# EAGLE schematic controller (EAGLE 7.2.0)
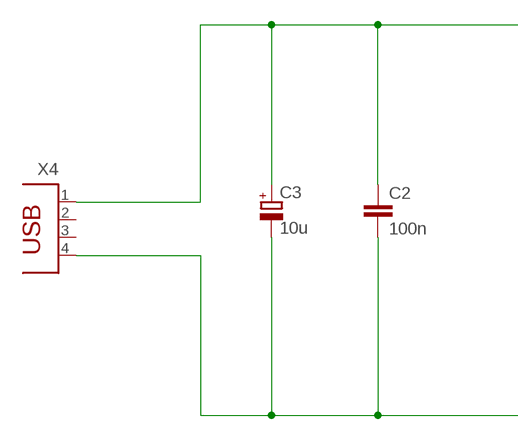
[diagram p0: schematic, sheet 1, part 1 of 2]
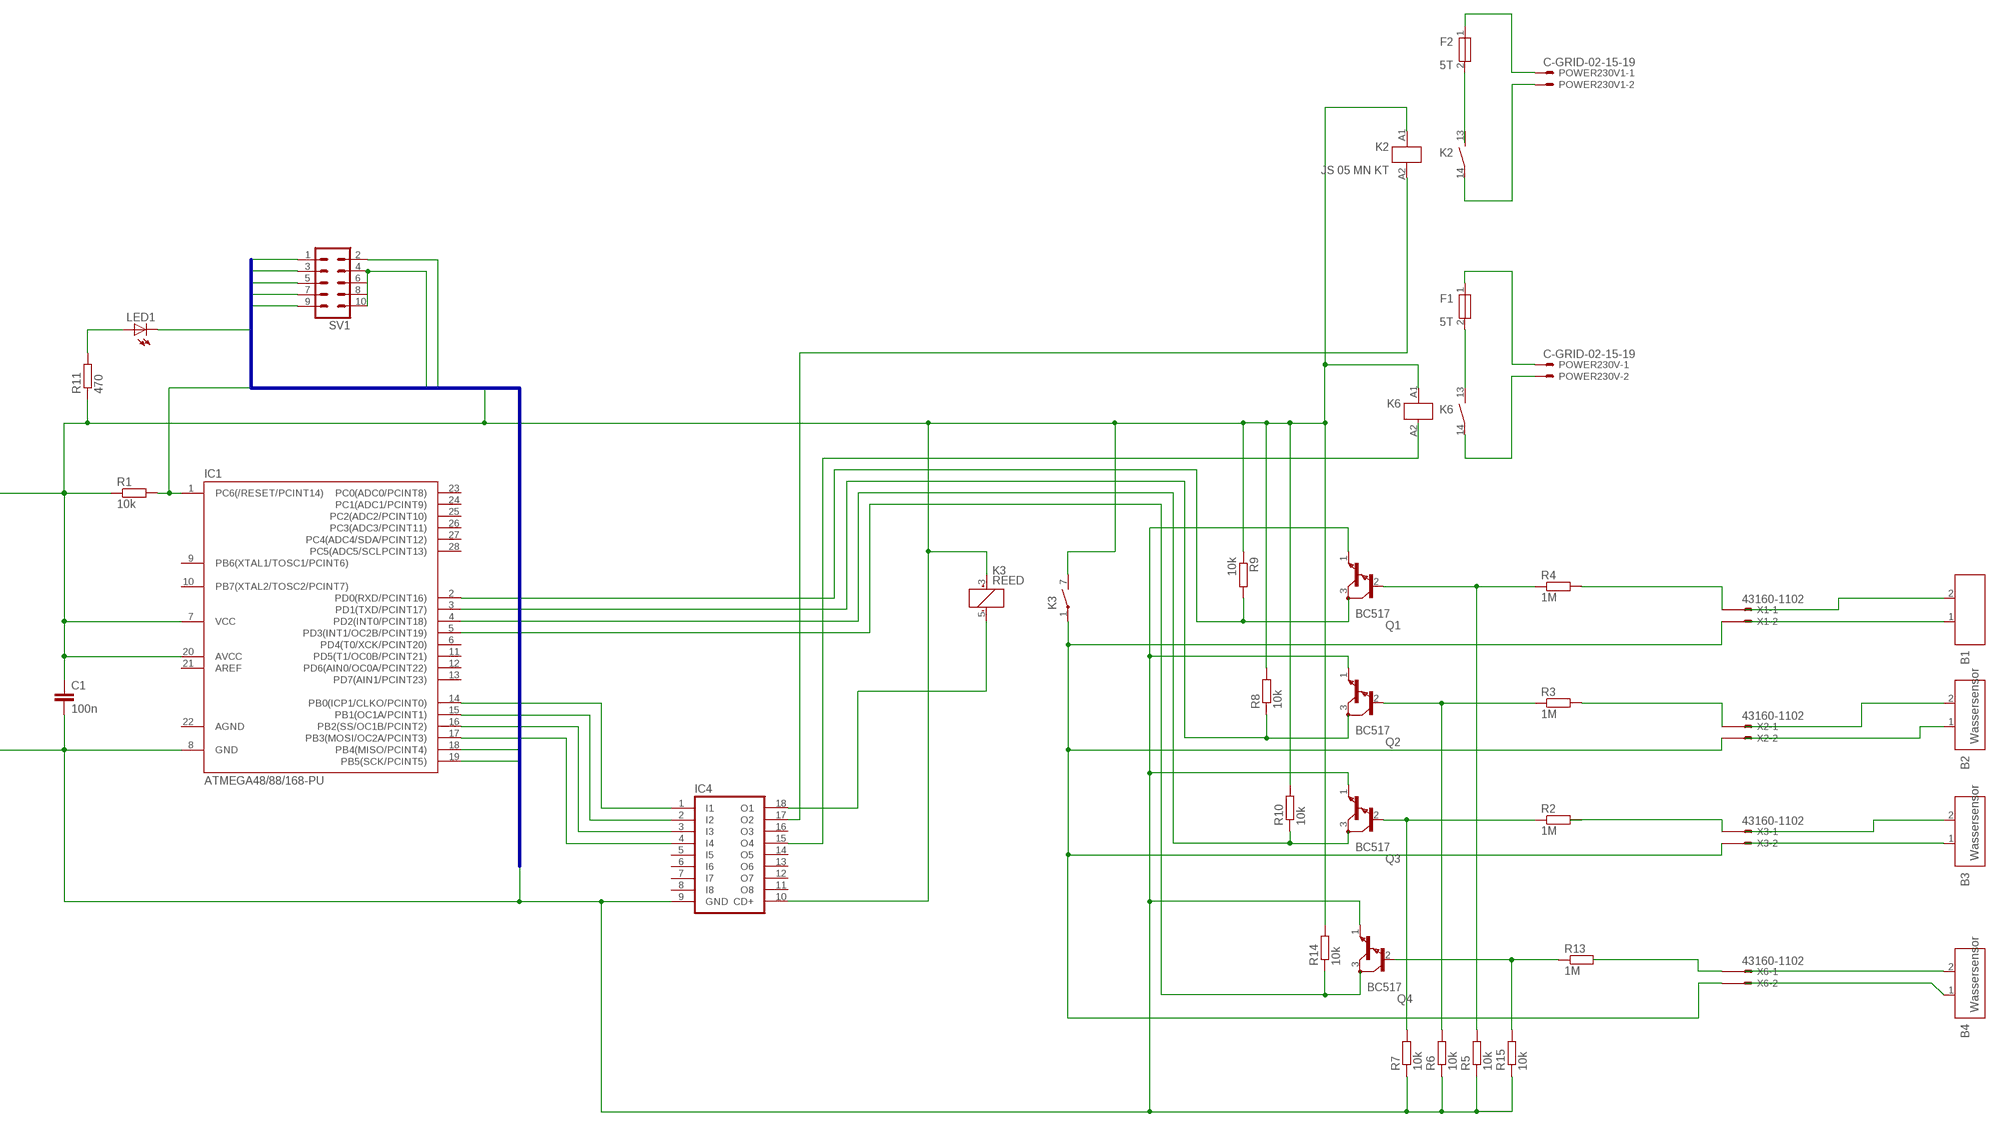
[diagram p1: schematic, sheet 1, part 2 of 2]

## Parts
B1  MESSFUEHLER_2  [MESSFUEHLER_2]
B2  MESSFUEHLER_2  [MESSFUEHLER_2]
B3  MESSFUEHLER_2  [MESSFUEHLER_2]
B4  MESSFUEHLER_2  [MESSFUEHLER_2]
C1  100n  C-EU025-025X050  [C025-025X050]
C2  100n  C-EU025-030X050  [C025-030X050]
C3  10u  CPOL-EUE2.5-7  [E2,5-7]
F1  SICHERUNG_1-POL  [SICHERUNG_1-POL]
F2  SICHERUNG_1-POL  [SICHERUNG_1-POL]
IC1  ATMEGA48/88/168-PU  [DIL28-3]
IC4  ULN2803A  [DIL18]
K2  HILFSSCHUETZ_13-14  [HILFSSCHUETZ_13-14]
K3  REED  [REED]
K6  HILFSSCHUETZ_13-14  [HILFSSCHUETZ_13-14]
LED1  LED5MM  [LED5MM]
POWER230V  C-GRID-02-15-19  [15-91-02]
POWER230V1  C-GRID-02-15-19  [15-91-02]
Q1  BC517  [TO92]
Q2  BC517  [TO92]
Q3  BC517  [TO92]
Q4  BC517  [TO92]
R1  10k  R-EU_0204/7  [0204/7]
R2  1M  R-EU_0204/7  [0204/7]
R3  1M  R-EU_0204/7  [0204/7]
R4  1M  R-EU_0204/7  [0204/7]
R5  10k  R-EU_0204/7  [0204/7]
R6  10k  R-EU_0204/7  [0204/7]
R7  10k  R-EU_0204/7  [0204/7]
R8  10k  R-EU_0204/7  [0204/7]
R9  10k  R-EU_0204/7  [0204/7]
R10  10k  R-EU_0204/7  [0204/7]
R11  470  R-EU_0204/7  [0204/7]
R13  1M  R-EU_0204/7  [0204/7]
R14  10k  R-EU_0204/7  [0204/7]
R15  10k  R-EU_0204/7  [0204/7]
SV1  MA05-2  [MA05-2]
X1  43160-1102  [43160-XX02]
X2  43160-1102  [43160-XX02]
X3  43160-1102  [43160-XX02]
X4  PN87520  [PN87520]
X6  43160-1102  [43160-XX02]

## Nets
GND: C1.2 C2.2 C3.- IC1.8(GND) IC4.9(GND) Q1.1(E) Q2.1(E) Q3.1(E) Q4.1(E) R5.1 R6.1 R7.1 R15.1 SV1.2 SV1.4 SV1.10 X4.4
LED: LED1.K(C) SV1.3
MISO: IC1.18(PB4(MISO/PCINT4)) SV1.9
MOSI: IC1.17(PB3(MOSI/OC2A/PCINT3)) IC4.4(I4) SV1.1
N$1: IC4.15(O4)
N$2: LED1.A R11.2
N$3: IC4.18(O1) K3.5(1:-)
N$4: B4.2
N$5: B4.1
N$6: IC1.14(PB0(ICP1/CLKO/PCINT0)) IC4.1(I1)
N$7: IC1.15(PB1(OC1A/PCINT1)) IC4.2(I2)
N$8: IC1.16(PB2(SS/OC1B/PCINT2)) IC4.3(I3)
N$9: K3.1(2:P) X1.2@1(-2:S) X2.2@1(-2:S) X3.2@1(-2:S) X6.2@1(-2:S)
N$10: X6.1@1(-1:S)
N$11: Q4.2(B) R13.1 R15.2
N$12: Q3.2(B) R2.1 R7.2
N$13: Q2.2(B) R3.1 R6.2
N$14: Q1.2(B) R4.1 R5.2
N$15: R4.2 X1.1@1(-1:S)
N$16: R3.2 X2.1@1(-1:S)
N$17: R2.2 X3.1@1(-1:S)
N$18: IC1.5(PD3(INT1/OC2B/PCINT19)) Q4.3(C) R14.1
N$19: IC1.2(PD0(RXD/PCINT16)) Q1.3(C) R9.2
N$20: B1.2
N$21: B1.1
N$22: IC1.3(PD1(TXD/PCINT17)) Q2.3(C) R8.1
N$23: IC1.4(PD2(INT0/PCINT18)) Q3.3(C) R10.1
N$24: B2.2
N$25: B2.1
N$26: B3.2
N$27: B3.1
N$28: F1.2 K6.13
N$30: K6.14 POWER230V.2
N$31: IC4.17(O2) K2.A2
N$32: F1.1 POWER230V.1
N$33: F2.2
N$34: F2.1 POWER230V1.1
N$35: K2.14 POWER230V1.2
RESET: IC1.1(PC6(/RESET/PCINT14)) R1.2 SV1.5
SCK: IC1.19(PB5(SCK/PCINT5)) SV1.7
VCC: C1.1 C2.1 C3.+ IC1.7(VCC) IC1.20(AVCC) IC4.10(CD+) K2.A1 K3.3(1:+) K3.7(2:S) K6.A1 R1.1 R8.2 R9.1 R10.2 R11.1 R14.2 X4.1
Unconnected: IC1.6(PD4(T0/XCK/PCINT20)) IC1.9(PB6(XTAL1/TOSC1/PCINT6)) IC1.10(PB7(XTAL2/TOSC2/PCINT7)) IC1.11(PD5(T1/OC0B/PCINT21)) IC1.12(PD6(AIN0/OC0A/PCINT22)) IC1.13(PD7(AIN1/PCINT23)) IC1.21(AREF) IC1.23(PC0(ADC0/PCINT8)) IC1.24(PC1(ADC1/PCINT9)) IC1.25(PC2(ADC2/PCINT10)) IC1.26(PC3(ADC3/PCINT11)) IC1.27(PC4(ADC4/SDA/PCINT12)) IC1.28(PC5(ADC5/SCLPCINT13)) IC4.5(I5) IC4.6(I6) IC4.7(I7) IC4.8(I8) IC4.11(O8) IC4.12(O7) IC4.13(O6) IC4.14(O5) IC4.16(O3) K2.13 K6.A2 R13.2 SV1.6 SV1.8 X1.1@2(-1:S) X1.2@2(-2:S) X2.1@2(-1:S) X2.2@2(-2:S) X3.1@2(-1:S) X3.2@2(-2:S) X4.2 X4.3 X6.1@2(-1:S) X6.2@2(-2:S)

## Buses
MOSI,LED,RESET,SCK,MISO,VCC,GND

## Power pins joined to a net without a drawn wire
AGND: IC1.22(AGND)

## Library data of the parts
B1-B4 = e-messfuehler:MESSFUEHLER_2: Messfühler mit zwei Anschlüssen; FUNKTION: Wassersensor
C1 C2 = resistor:C-EU: CAPACITOR, European symbol
C3 = resistor:CPOL-EU: POLARIZED CAPACITOR, European symbol
F1 F2 = e-sicherungen:SICHERUNG_1-POL: Sicherung, 1-pol.; TYPE: 5T
IC1 = atmega8:ATMEGA48/88/168-PU
IC4 = uln-udn:ULN2803A: DRIVER ARRAY
K2 K6 = e-schuetze-relais:HILFSSCHUETZ_13-14: Hilfsschütz mit 1 Schließer; TYPE: JS 05 MN KT
K3 = relay:REED: RELAY reed, 1 x norm. open with polarity, grid 5.08; OC_FARNELL: unknown; OC_NEWARK: unknown
LED1 = led:LED: LED OSRAM: - CHIPLED LG R971, LG N971, LY N971, LG Q971, LY Q971, LO R971, LY R971 LH N974, LH R974 LS Q976, LO Q976, LY Q976 LO Q996 - Hyper CHIPLED LW Q18S LB Q993, LB Q99A, LB R99A - SideLED LS A670, LO A670, LY A670, LG A670, LP A670 LB A673, LV A673, LT A673, LW A673 LH A674 LY A675 LS A676, LA A676, LO A676, LY A676, LW A676 LS A679, LY A679, LG A679 - Hyper Micro SIDELED® LS Y876, LA Y876, LO Y876, LY Y876 LT Y87S - SmartLED LW L88C, LW L88S LB L89C, LB L89S, LG L890 LS L89K, LO L89K, LY L89K LS L896, LA L896, LO L896, LY L896 - TOPLED LS T670, LO T670, LY T670, LG T670, LP T670 LSG T670, LSP T670, LSY T670, LOP T670, LYG T670 LG T671, LOG T671, LSG T671 LB T673, LV T673, LT T673, LW T673 LH T674 LS T676, LA T676, LO T676, LY T676, LB T676, LH T676, LSB T676, LW T676 LB T67C, LV T67C, LT T67C, LS T67K, LO T67K, LY T67K, LW E67C LS E67B, LA E67B, LO E67B, LY E67B, LB E67C, LV E67C, LT E67C LW T67C LS T679, LY T679, LG T679 LS T770, LO T770, LY T770, LG T770, LP T770 LB T773, LV T773, LT T773, LW T773 LH T774 LS E675, LA E675, LY E675, LS T675 LS T776, LA T776, LO T776, LY T776, LB T776 LHGB T686 LT T68C, LB T68C - Hyper Mini TOPLED® LB M676 - Mini TOPLED Santana® LG M470 LS M47K, LO M47K, LY M47K Source: http://www.osram.convergy.de LUXEON: - LUMILED® LXK2-PW12-R00, LXK2-PW12-S00, LXK2-PW14-U00, LXK2-PW14-V00 LXK2-PM12-R00, LXK2-PM12-S00, LXK2-PM14-U00 LXK2-PE12-Q00, LXK2-PE12-R00, LXK2-PE12-S00, LXK2-PE14-T00, LXK2-PE14-U00 LXK2-PB12-K00, LXK2-PB12-L00, LXK2-PB12-M00, LXK2-PB14-N00, LXK2-PB14-P00, LXK2-PB14-Q00 LXK2-PR12-L00, LXK2-PR12-M00, LXK2-PR14-Q00, LXK2-PR14-R00 LXK2-PD12-Q00, LXK2-PD12-R00, LXK2-PD12-S00 LXK2-PH12-R00, LXK2-PH12-S00 LXK2-PL12-P00, LXK2-PL12-Q00, LXK2-PL12-R00 Source: www.luxeon.com KINGBRIGHT: KA-3528ASYC Source: www.kingbright.com
POWER230V POWER230V1 = con-molex:C-GRID-02: CONNECTOR wire to board 2.54 mm (0.100") pitch header; OC_FARNELL: unknown; OC_NEWARK: unknown
Q1-Q4 = transistor-npn:BC517*: NPN Darlington Transistor
R1-R11 R13-R15 = resistor:R-EU_: RESISTOR, European symbol
SV1 = con-lstb:MA05-2: PIN HEADER; OC_FARNELL: unknown; OC_NEWARK: unknown
X1-X3 X6 = con-molex:43160-*02: SDA-43160 Connector Source: http://www.molex.com/pdm_docs/sd/431601306_sd.pdf; MF: WALDOM/MOLEX; MPN: 43160-1102; OC_FARNELL: unknown; OC_NEWARK: 54H0255
X4 = con-berg:PN87520: BERG USB connector; OC_FARNELL: unknown; OC_NEWARK: unknown